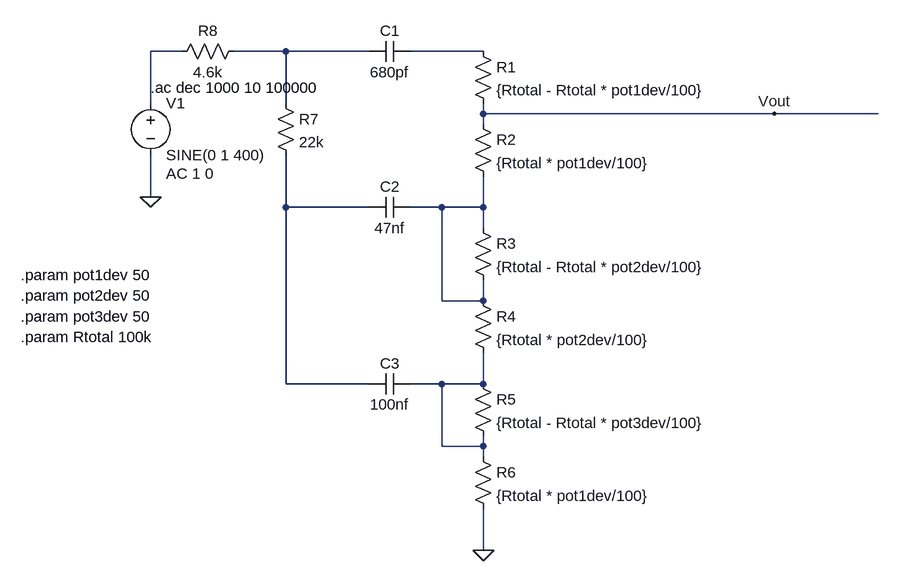
[diagram p0: schematic tone_stack_sim.asc]
tone_stack_sim.asc, the LTspice schematic file:
Version 4.1
SHEET 1 880 872
WIRE -272 64 -320 64
WIRE -112 64 -192 64
WIRE 16 64 -112 64
WIRE 192 64 80 64
WIRE -320 144 -320 64
WIRE -112 144 -112 64
WIRE 192 160 192 144
WIRE 640 160 192 160
WIRE 800 160 640 160
WIRE 192 176 192 160
WIRE -320 288 -320 224
WIRE -112 304 -112 224
WIRE 16 304 -112 304
WIRE 128 304 80 304
WIRE 192 304 192 256
WIRE 192 304 128 304
WIRE 192 336 192 304
WIRE 128 448 128 304
WIRE 192 448 192 416
WIRE 192 448 128 448
WIRE -112 576 -112 304
WIRE 16 576 -112 576
WIRE 128 576 80 576
WIRE 192 576 192 528
WIRE 192 576 128 576
WIRE 128 672 128 576
WIRE 192 672 192 656
WIRE 192 672 128 672
WIRE 192 688 192 672
WIRE 192 832 192 768
FLAG 192 832 0
FLAG -320 288 0
FLAG 640 160 Vout
SYMBOL res 176 48 R0
SYMATTR InstName R1
SYMATTR Value {Rtotal - Rtotal * pot1dev/100}
SYMBOL res 176 160 R0
SYMATTR InstName R2
SYMATTR Value {Rtotal * pot1dev/100}
SYMBOL res 176 320 R0
SYMATTR InstName R3
SYMATTR Value {Rtotal - Rtotal * pot2dev/100}
SYMBOL res 176 432 R0
SYMATTR InstName R4
SYMATTR Value {Rtotal * pot2dev/100}
SYMBOL res 176 560 R0
SYMATTR InstName R5
SYMATTR Value {Rtotal - Rtotal * pot3dev/100}
SYMBOL res 176 672 R0
SYMATTR InstName R6
SYMATTR Value {Rtotal * pot1dev/100}
SYMBOL cap 80 48 R90
WINDOW 0 0 32 VBottom 2
WINDOW 3 32 32 VTop 2
SYMATTR InstName C1
SYMATTR Value 680pf
SYMBOL cap 80 288 R90
WINDOW 0 0 32 VBottom 2
WINDOW 3 32 32 VTop 2
SYMATTR InstName C2
SYMATTR Value 47nf
SYMBOL cap 80 560 R90
WINDOW 0 0 32 VBottom 2
WINDOW 3 32 32 VTop 2
SYMATTR InstName C3
SYMATTR Value 100nf
SYMBOL voltage -320 128 R0
WINDOW 123 24 124 Left 2
WINDOW 39 0 0 Left 0
SYMATTR Value2 AC 1 0
SYMATTR InstName V1
SYMATTR Value SINE(0 1 400)
SYMBOL res -128 128 R0
SYMATTR InstName R7
SYMATTR Value 22k
SYMBOL res -176 48 R90
WINDOW 0 0 56 VBottom 2
WINDOW 3 32 56 VTop 2
SYMATTR InstName R8
SYMATTR Value 4.6k
TEXT -520 408 Left 2 !.param pot1dev 50
TEXT -520 440 Left 2 !.param pot2dev 50
TEXT -520 472 Left 2 !.param pot3dev 50
TEXT -320 120 Left 2 !.ac dec 1000 10 100000
TEXT -520 504 Left 2 !.param Rtotal 100k

The netlist it stands for:
* tone_stack_sim.asc
R1 N003 Vout {Rtotal - Rtotal * pot1dev/100}
R2 Vout N005 {Rtotal * pot1dev/100}
R3 N005 N005 {Rtotal - Rtotal * pot2dev/100}
R4 N005 N006 {Rtotal * pot2dev/100}
R5 N006 N006 {Rtotal - Rtotal * pot3dev/100}
R6 N006 0 {Rtotal * pot1dev/100}
C1 N003 N002 680pf
C2 N005 N004 47nf
C3 N006 N004 100nf
V1 N001 0 SINE(0 1 400) AC 1 0
R7 N002 N004 22k
R8 N002 N001 4.6k
.param pot1dev 50
.param pot2dev 50
.param pot3dev 50
.ac dec 1000 10 100000
.param Rtotal 100k
.backanno
.end